# Altium project HIL_RIG_Hardware.PrjPcb (part 3 of 11)

## Sheet  Digital_Input.SchDoc
size A3; SheetNumber: 9; SheetTotal: 29
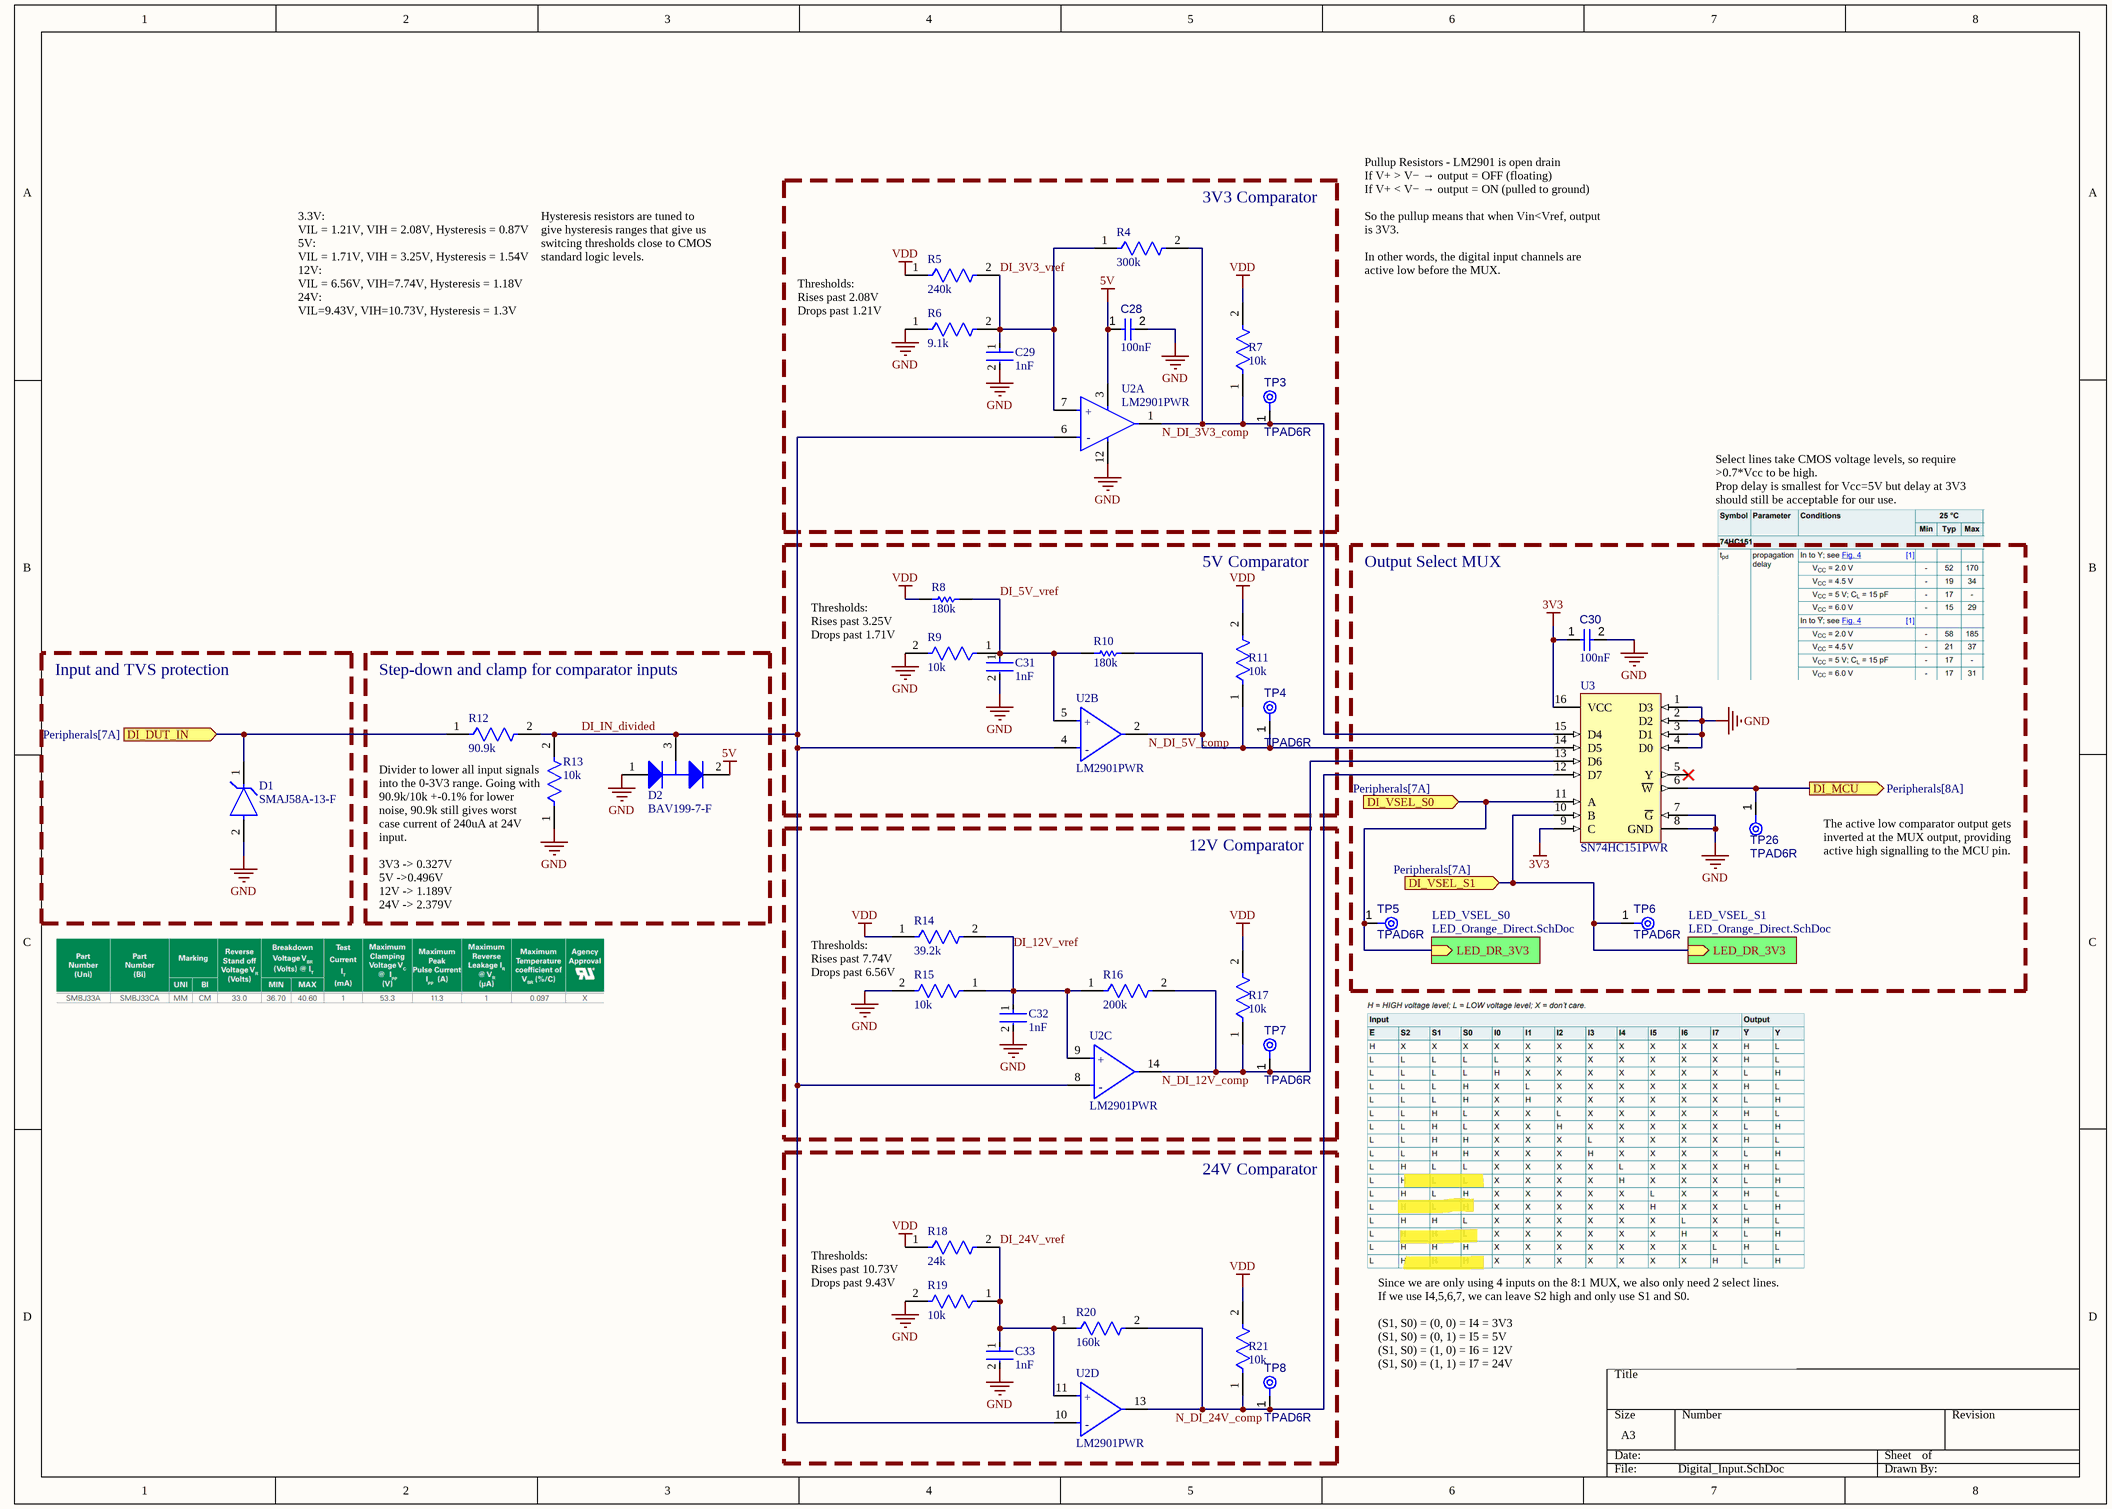
[diagram p5:  Digital_Input.SchDoc]

### Parts
C28  value 100nF  [CAPC1608X90X40NL10T20]  (hidden comment: Capacitor 100 nF +/-10% 50 V 0603)
C29  value 1nF  [FP-CC0603-DA-IPC_B]  (hidden comment: CC0603KRX7R7BB102)
C30  value 100nF  [CAPC1608X90X40NL10T20]  (hidden comment: Capacitor 100 nF +/-10% 50 V 0603)
C31  value 1nF  [FP-CC0603-DA-IPC_B]  (hidden comment: CC0603KRX7R7BB102)
C32  value 1nF  [FP-CC0603-DA-IPC_B]  (hidden comment: CC0603KRX7R7BB102)
C33  value 1nF  [FP-CC0603-DA-IPC_B]  (hidden comment: CC0603KRX7R7BB102)
D1  SMAJ58A-13-F  [FP-SMA-MFG]
D2  BAV199-7-F  [DIOD-SOT23-3_A_V]
R4  value 300k  [FP-RT0603-IPC_C]  (hidden comment: RT0603BRE07300KL)
R5  value 240k  [FP-RT0603-IPC_C]  (hidden comment: RT0603BRD07240KL)
R6  value 9.1k  [FP-RT0603-IPC_C]  (hidden comment: RT0603BRD079K1L)
R7  value 10k  [FP-RT0603-IPC_C]  (hidden comment: RT0603BRD0710KL)
R8  value 180k  [RESC1608X55X30NL20T20]  (hidden comment: ERA-3AEB184V)
R9  value 10k  [FP-RT0603-IPC_C]  (hidden comment: RT0603BRD0710KL)
R10  value 180k  [RESC1608X55X30NL20T20]  (hidden comment: ERA-3AEB184V)
R11  value 10k  [FP-RT0603-IPC_C]  (hidden comment: RT0603BRD0710KL)
R12  value 90.9k  [FP-RT0603-IPC_C]  (hidden comment: RT0603BRD0790K9L)
R13  value 10k  [FP-RT0603-IPC_C]  (hidden comment: RT0603BRD0710KL)
R14  value 39.2k  [FP-RT0603-IPC_C]  (hidden comment: RT0603BRD0739K2L)
R15  value 10k  [FP-RT0603-IPC_C]  (hidden comment: RT0603BRD0710KL)
R16  value 200k  [FP-AT0603-IPC_A]  (hidden comment: AT0603BRD07200KL)
R17  value 10k  [FP-RT0603-IPC_C]  (hidden comment: RT0603BRD0710KL)
R18  value 24k  [FP-TNPW0603-e3-IPC_A]  (hidden comment: TNPW060324K0BEEA)
R19  value 10k  [FP-RT0603-IPC_C]  (hidden comment: RT0603BRD0710KL)
R20  value 160k  [FP-RT0603-IPC_C]  (hidden comment: RT0603BRD07160KL)
R21  value 10k  [FP-RT0603-IPC_C]  (hidden comment: RT0603BRD0710KL)
TP3  TPAD6R  [TP06R]  (no BOM)
TP4  TPAD6R  [TP06R]  (no BOM)
TP5  TPAD6R  [TP06R]  (no BOM)
TP6  TPAD6R  [TP06R]  (no BOM)
TP7  TPAD6R  [TP06R]  (no BOM)
TP8  TPAD6R  [TP06R]  (no BOM)
TP26  TPAD6R  [TP06R]  (no BOM)
U2  LM2901PWR  [FP-PW0014A-IPC_B]  (parts A,B,C,D of 4)
U3  SN74HC151PWR  [PW0016A_L]

### Blocks framed on the sheet
3V3 Comparator: C28 C29 R4-R7 TP3 U2
5V Comparator: C31 R8-R11 TP4 U2
Output Select MUX: C30 TP5 TP6 TP26 U3
Input and TVS protection: D1
Step-down and clamp for comparator inputs: D2 R12 R13
12V Comparator: C32 R14-R17 TP7 U2
24V Comparator: C33 R18-R21 TP8 U2

### Sub-sheets
LED_VSEL_S0 = LED_Orange_Direct.SchDoc (file not in this document): LED_DR_3V3 (in)
LED_VSEL_S1 = LED_Orange_Direct.SchDoc (file not in this document): LED_DR_3V3 (in)

### Ports
DI_DUT_IN (in, see Peripherals[7A]), DI_MCU (out, see Peripherals[8A]), DI_VSEL_S0 (in, see Peripherals[7A]), DI_VSEL_S1 (in, see Peripherals[7A])

### Nets
3V3: C30.1 U3.9(C) U3.16(VCC)
5V: C28.1 D2.2(K) U2.3(VCC)
GND: C28.2 C29.2 C30.2 C31.2 C32.2 C33.2 D1.2(A) D2.1(A) R6.1 R9.2 R13.1 R15.2 R19.2 U2.12(GND) U3.1(D3) U3.2(D2) U3.3(D1) U3.4(D0) U3.7(~{G}) U3.8(GND)
VDD: R5.1 R7.2 R8.1 R11.2 R14.1 R17.2 R18.1 R21.2
DI_3V3_vref: C29.1 R4.1 R5.2 R6.2 U2.7(1IN+)
DI_5V_vref: C31.1 R8.2 R9.1 R10.1 U2.5(2IN+)
DI_12V_vref: C32.1 R14.2 R15.1 R16.1 U2.9(3IN+)
DI_24V_vref: C33.1 R18.2 R19.1 R20.1 U2.11(4IN+)
DI_IN_divided: D2.3(C) R12.2 R13.2 U2.4(2IN-) U2.6(1IN-) U2.8(3IN-) U2.10(4IN-)
N_DI_3V3_comp: R4.2 R7.1 TP3.1(TP) U2.1(1OUT) U3.15(D4)
N_DI_5V_comp: R10.2 R11.1 TP4.1(TP) U2.2(2OUT) U3.14(D5)
N_DI_12V_comp: R16.2 R17.1 TP7.1(TP) U2.14(OUT3) U3.13(D6)
N_DI_24V_comp: R20.2 R21.1 TP8.1(TP) U2.13(OUT4) U3.12(D7)
NetD1_1: D1.1(C) R12.1 ; port DI_DUT_IN
NetTP5_1: TP5.1(TP) U3.11(A) ; port DI_VSEL_S0, sheet LED_VSEL_S0/LED_DR_3V3
NetTP6_1: TP6.1(TP) U3.10(B) ; port DI_VSEL_S1, sheet LED_VSEL_S1/LED_DR_3V3
NetTP26_1: TP26.1(TP) U3.6(~{W}) ; port DI_MCU

Not connected (* = marked no-connect by the designer): U3 5(Y)*

### Notes on the sheet
- 3.3V:
  VIL = 1.21V, VIH = 2.08V, Hysteresis = 0.87V
  5V:
  VIL = 1.71V, VIH = 3.25V, Hysteresis = 1.54V
  12V:
  VIL = 6.56V, VIH=7.74V, Hysteresis = 1.18V
  24V:
  VIL=9.43V, VIH=10.73V, Hysteresis = 1.3V
- Hysteresis resistors are tuned to give hysteresis ranges that give us switcing thresholds close to CMOS standard logic levels.
- Pullup Resistors - LM2901 is open drain
  If V+ > V− → output = OFF (floating)
  If V+ < V− → output = ON (pulled to ground)
  So the pullup means that when Vin<Vref, output is 3V3.
  In other words, the digital input channels are active low before the MUX.
- Thresholds:
  Rises past 2.08V
  Drops past 1.21V
- Select lines take CMOS voltage levels, so require >0.7*Vcc to be high.
  Prop delay is smallest for Vcc=5V but delay at 3V3 should still be acceptable for our use.
- Thresholds:
  Rises past 3.25V
  Drops past 1.71V
- The active low comparator output gets inverted at the MUX output, providing active high signalling to the MCU pin.
- (near R13) Divider to lower all input signals into the 0-3V3 range. Going with 90.9k/10k +-0.1% for lower noise, 90.9k still gives worst case current of 240uA at 24V input.
  3V3 -> 0.327V
  5V ->0.496V
  12V -> 1.189V
  24V -> 2.379V
- Thresholds:
  Rises past 7.74V
  Drops past 6.56V
- Thresholds:
  Rises past 10.73V
  Drops past 9.43V
- Since we are only using 4 inputs on the 8:1 MUX, we also only need 2 select lines.
  If we use I4,5,6,7, we can leave S2 high and only use S1 and S0.
  (S1, S0) = (0, 0) = I4 = 3V3
  (S1, S0) = (0, 1) = I5 = 5V
  (S1, S0) = (1, 0) = I6 = 12V
  (S1, S0) = (1, 1) = I7 = 24V

### Library data of the parts
C28 C30 = CMP-001-00017-6: Chip Capacitor, 100 nF, +/- 10%, 50 V, 0603 (1608 Metric); Voltage Rating: 50V; Capacitor Type: Ceramic; Tolerance: 10%; Mounting Technology: SM; Max Operating Temperature: 125°C; RoHS Compliant: True; Pins: 2; Case/Package: 0603; Min Operating Temperature: -55°C
C29 C31-C33 = CMP-001-00137-1: 16V 1nF X7R ±10% 0603 Multilayer Ceramic Capacitors MLCC - SMD/SMT ROHS; Min Operating Temperature: -55°C; Dielectric Material: Ceramic; Max Operating Temperature: 125°C; REACH SVHC: Yes; Lifecycle Status: Production; Voltage Rating: 16V; Mounting Technology: Surface Mount; Width: 800µm; Height: 800µm; Case/Package: 0603; RoHS: Compliant; Voltage Rating (DC): 16V; Length: 1.6mm; Number of Terminals: 2; Tolerance: 10%; Dielectric: X7R; Material: Ceramic; China RoHS: Compliant; Case Code (Imperial): 0603; Case Code (Metric): 1608; Composition: Ceramic; Depth: 800µm; Halogen Free: Halogen Free; Lead Free: Lead Free; Packaging: Tape and Reel; Radiation Hardening: No; Schedule B: 8532240020, 8532240020; Termination: SMD/SMT; Thickness: 889µm; Weight: 2.012816mg
D1 = CMP-004-00082-1: SMAJ Series 58 V 400 W SMT Uni-Directional TVS Diode - DO-214AC; Forward Voltage: 3.5V; Max Surge Current: 40A; Case/Package: SMA; Max Operating Temperature: 150°C; Min Operating Temperature: -55°C; Mounting Technology: Surface Mount; Pins: 2
D2 = CMP-004-00056-1: Diode Standard Recovery Rectifier 85 Volt 0.16A 3-Pin SOT-23 Tape and Reel; Max Surge Current: 4A; Forward Current: 150mA; Forward Voltage: 900mV; Pins: 3; Case/Package: SOT-23; Max Operating Temperature: 150°C; Mounting Technology: Surface Mount; Min Operating Temperature: -65°C
R4 = CMP-009-00251-1: 100mW Thin Film Resistor ±50ppm/℃ ±0.1% 300kΩ 0603 Chip Resistor - Surface Mount ROHS; Voltage Rating (DC): 50V; Voltage Rating: 75V; Temperature Coefficient: 50ppm/°C; Min Operating Temperature: -55°C; Export Control Classification Number (ECCN) Code: EAR99; China RoHS: Non-Compliant; Number of Terminals: 2; Max Power Dissipation: 100mW; Radiation Hardening: No; Mounting Technology: Surface Mount; Width: 800µm; Case Code (Metric): 0603; RoHS: Compliant; Contact Plating: Tin; Lead Free: Lead Free; Power Dissipation: 100mW; Packaging: Tape & Reel (TR); Height: 450µm; Tolerance: 0.1%; REACH SVHC: Yes; Harmonized Tariff Schedule (HTS) Code: 8533.21.00.30; Length: 1.6mm; Max Operating Temperature: 155°C; Working Voltage: 75V; Case/Package: 0603; Power Rating: 100mW; Number of Terminations: 2; Country of Origin: Mainland China, Taiwan; Introduction Date: 2008-07-11; Lifecycle Status: Production; Composition: Thin Film
R5 = CMP-009-00288-1: Res Thin Film 0603 240K Ohm 0.1% 0.1W(1/10W) ±25ppm/C Pad SMD T/R; Temperature Coefficient: 25ppm/°C; Power Rating: 100mW; Voltage Rating (DC): 50V; Working Voltage: 75V; Height: 450µm; Max Operating Temperature: 155°C; Case/Package: 0603; Composition: Thin Film; China RoHS: Non-Compliant; Lifecycle Status: Production; Harmonized Tariff Schedule (HTS) Code: 8533.21.00.30; RoHS: Compliant; Mounting Technology: Surface Mount; Introduction Date: 2008-06-09; Tolerance: 0.1%; Features: Moisture Resistant; Export Control Classification Number (ECCN) Code: EAR99; Case Code (Imperial): 0603; Max Power Dissipation: 100mW; Voltage Rating: 75V; Min Operating Temperature: -55°C; Country of Origin: Mainland China, Taiwan; Schedule B: 8533210045, 8533210045; Number of Terminations: 2; Lead Free: Lead Free; Number of Terminals: 2; Length: 1.6mm; REACH SVHC: Yes; Width: 800µm; Radiation Hardening: No; Contact Plating: Tin; Termination: SMD/SMT
R6 = CMP-009-00287-1: 100mW Thin Film Resistor 75V ±25ppm/℃ ±0.1% 9.1kΩ 0603 Chip Resistor - Surface Mount ROHS; Temperature Coefficient: 25ppm/°C; Voltage Rating (DC): 50V; Case/Package: 0603; REACH SVHC: Yes; Height: 450µm; Max Operating Temperature: 155°C; Width: 800µm; Termination: SMD/SMT; Weight: 2.012816mg; Lead Free: Lead Free; Radiation Hardening: No; Number of Terminals: 2; Harmonized Tariff Schedule (HTS) Code: 8533.21.00.30; RoHS: Compliant; Composition: Thin Film; Case Code (Imperial): 0603; Country of Origin: Mainland China, Taiwan; Max Power Dissipation: 100mW; Voltage Rating: 75V; Introduction Date: 2008-07-11; Depth: 800µm; Number of Terminations: 2; Length: 1.6mm; Export Control Classification Number (ECCN) Code: EAR99; Military Standard: Not; Schedule B: 8533210045, 8533210045; Tolerance: 0.1%; Working Voltage: 75V; Lifecycle Status: Production; Power Rating: 100mW; Mounting Technology: Surface Mount; Features: Moisture Resistant; Min Operating Temperature: -55°C; Contact Plating: Tin; China RoHS: Non-Compliant
R7 R11 R17 R21 = CMP-009-00322-1: Res Thin Film 0603 10K Ohm 0.1% 1/10W |25ppm/|C SMD Paper T/R; Voltage Rating: 75V; Max Power Dissipation: 100mW; Temperature Coefficient: 25ppm/°C; Min Operating Temperature: -55°C; Case/Package: 0603; Mounting Technology: Surface Mount; Max Operating Temperature: 155°C; Tolerance: 0.1%; Case Code (Imperial): 0603; China RoHS: Non-Compliant; Composition: Thin Film; Country of Origin: Mainland China, Taiwan; Depth: 800µm; Export Control Classification Number (ECCN) Code: EAR99; Features: Moisture Resistant; Harmonized Tariff Schedule (HTS) Code: 8533.21.00.30; Height: 450µm; Introduction Date: 2008-06-09; Lead Free: Lead Free; Length: 1.6mm; Lifecycle Status: Production; Military Standard: Not; Number of Terminals: 2; Number of Terminations: 2; Power Rating: 100mW; REACH SVHC: Yes; RoHS: Compliant; Schedule B: 8533210045, 8533210045; Termination: SMD/SMT; Voltage Rating (DC): 75V; Weight: 2.012816mg; Width: 800µm; Working Voltage: 75V
R8 R10 = CMP-009-00332-1: Res Thin Film 0603 180K Ohm 0.1% 0.1W ±25ppm/°C Molded SMD Punched Carrier T/R; Manufacturer Lifecycle Status: ACTIVE; Part Series: Thin Film Chip Resistors, High Reliability Type; Max Power Dissipation: 100mW; Voltage Rating (DC): 75V; Min Operating Temperature: -55°C; Termination: SMD/SMT; Features: Automotive AEC-Q200; Radiation Hardening: No; REACH SVHC: Yes; Lifecycle Status: Production; Contact Plating: Tin; Mounting Technology: Surface Mount; Ratings: AEC-Q200; Case/Package: 0603; Depth: 800µm; Harmonized Tariff Schedule (HTS) Code: 8533.21.00.30; Schedule B: 8533210045, 8533210045; Composition: Thin Film; Number of Terminations: 2; Country of Origin: Japan; RoHS: Compliant; Working Voltage: 75V; Introduction Date: 2008-03-19; Temperature Coefficient: 25ppm/°C; Case Code (Imperial): 0603; Tolerance: 0.1%; Voltage Rating: 75V; Military Standard: Not; Packaging: Cut Tape; Power Rating: 100mW; Export Control Classification Number (ECCN) Code: EAR99; Number of Terminals: 2; Length: 1.6mm; Height: 450µm; Max Operating Temperature: 155°C; Lead Free: Lead Free; Pins: 2; Width: 800µm
R9 R13 R15 R19 = CMP-009-00322-1: Res Thin Film 0603 10K Ohm 0.1% 1/10W |25ppm/|C SMD Paper T/R; Power Rating: 100mW; Voltage Rating: 75V; Temperature Coefficient: 25ppm/°C; Width: 800µm; Country of Origin: Mainland China, Taiwan; Military Standard: Not; China RoHS: Non-Compliant; Composition: Thin Film; Schedule B: 8533210045, 8533210045; Max Operating Temperature: 155°C; Export Control Classification Number (ECCN) Code: EAR99; Lead Free: Lead Free; Number of Terminals: 2; Voltage Rating (DC): 75V; Introduction Date: 2008-06-09; Tolerance: 0.1%; Number of Terminations: 2; Case/Package: 0603; Depth: 800µm; Max Power Dissipation: 100mW; RoHS: Compliant; Harmonized Tariff Schedule (HTS) Code: 8533.21.00.30; Lifecycle Status: Production; Length: 1.6mm; Min Operating Temperature: -55°C; Features: Moisture Resistant; Case Code (Imperial): 0603; REACH SVHC: Yes; Mounting Technology: Surface Mount; Working Voltage: 75V; Height: 450µm; Termination: SMD/SMT; Weight: 2.012816mg
R12 = CMP-009-00290-1: 100mW Thin Film Resistor 75V ±25ppm/℃ ±0.1% 90.9kΩ 0603 Chip Resistor - Surface Mount ROHS; Temperature Coefficient: 25ppm/°C; Voltage Rating (DC): 50V; Features: Moisture Resistant; Schedule B: 8533210045, 8533210045; Case Code (Imperial): 0603; Radiation Hardening: No; Composition: Thin Film; Working Voltage: 75V; Harmonized Tariff Schedule (HTS) Code: 8533.21.00.30; Country of Origin: Mainland China, Taiwan; Lifecycle Status: Production; Export Control Classification Number (ECCN) Code: EAR99; Number of Terminals: 2; China RoHS: Non-Compliant; Width: 800µm; Number of Terminations: 2; Termination: SMD/SMT; Max Operating Temperature: 155°C; Introduction Date: 2008-06-09; Tolerance: 0.1%; Max Power Dissipation: 100mW; Military Standard: Not; RoHS: Compliant; Power Rating: 100mW; Voltage Rating: 75V; Height: 450µm; Min Operating Temperature: -55°C; Case/Package: 0603; Depth: 800µm; Length: 1.6mm; REACH SVHC: Yes; Lead Free: Lead Free; Contact Plating: Tin; Mounting Technology: Surface Mount
R14 = CMP-009-00347-1: 100mW Thin Film Resistor ±25ppm/℃ ±0.1% 39.2kΩ 0603 Chip Resistor - Surface Mount ROHS; Temperature Coefficient: 25ppm/°C; Voltage Rating: 75V; Voltage Rating (DC): 50V; Width: 800µm; Contact Plating: Tin; Mounting Technology: Surface Mount; Min Operating Temperature: -55°C; Case/Package: 0603; Termination: SMD/SMT; Case Code (Imperial): 0603; Number of Terminations: 2; Max Power Dissipation: 100mW; Lead Free: Lead Free; Schedule B: 8533210045, 8533210045; China RoHS: Non-Compliant; Height: 450µm; Length: 1.6mm; Military Standard: Not; Features: Moisture Resistant; Power Rating: 100mW; REACH SVHC: Yes; Radiation Hardening: No; Tolerance: 0.1%; Max Operating Temperature: 155°C; Lifecycle Status: Production; Working Voltage: 75V; Weight: 2.012816mg; Number of Terminals: 2; Composition: Thin Film; Depth: 800µm; RoHS: Compliant
R16 = CMP-009-00344-1: 100mW Thin Film Resistor ±25ppm/℃ ±0.1% 200kΩ 0603 Chip Resistor - Surface Mount ROHS; Voltage Rating: 75V; Temperature Coefficient: 25ppm/°C; Lifecycle Status: Production; Length: 1.6mm; Min Operating Temperature: -55°C; Number of Terminals: 2; Width: 800µm; Introduction Date: 2015-05-11; Mounting Technology: Surface Mount; Features: Anti-Sulfur, Automotive AEC-Q200, Moisture Resistant; Country of Origin: Mainland China, Taiwan; Tolerance: 0.1%; Export Control Classification Number (ECCN) Code: EAR99; Max Power Dissipation: 100mW; RoHS: Compliant; Power Rating: 100mW; Case/Package: 0603; Number of Terminations: 2; Working Voltage: 75V; Composition: Thin Film; REACH SVHC: Yes; Harmonized Tariff Schedule (HTS) Code: 8533.21.00.30; Max Operating Temperature: 155°C; China RoHS: Compliant; Height: 450µm; Ratings: AEC-Q200
R18 = CMP-009-00298-1: Res Thin Film 0603 24K Ohm 0.1% 1/8W ±25ppm/°C Molded SMD SMD Paper T/R; Max Power Dissipation: 100mW; Working Voltage: 75V; Voltage Rating (DC): 50V; Military Standard: Not; Radiation Hardening: No; Tolerance: 0.1%; Lifecycle Status: Production; Length: 1.55mm; Packaging: Tape & Reel; China RoHS: Compliant; Export Control Classification Number (ECCN) Code: EAR99; Lead Free: Lead Free; Number of Terminals: 2; Min Operating Temperature: -55°C; Depth: 850µm; Weight: 2.012816mg; Contact Plating: Tin; Composition: Thin Film; Country of Origin: Germany, Israel; Schedule B: 8533210045, 8533210045; Power Rating: 100mW; Case Code (Metric): 1608; Termination: SMD/SMT; Width: 850µm; Height: 450µm; Number of Terminations: 2; Introduction Date: 2006-07-14; Ratings: AEC-Q200; Case Code (Imperial): 0603; Voltage Rating: 75V; Mounting Technology: Surface Mount; Case/Package: 0603; REACH SVHC: Yes; Temperature Coefficient: 25ppm/°C; RoHS: Compliant; Harmonized Tariff Schedule (HTS) Code: 8533.21.00.30; Max Operating Temperature: 125°C; Features: Anti-Sulfur, Automotive AEC-Q200, Moisture Resistant; Pins: 2
R20 = CMP-009-00297-1: Res Thin Film 0603 160K Ohm 0.1% 0.1W(1/10W) ±25ppm/C Pad SMD T/R; Voltage Rating (DC): 50V; Temperature Coefficient: 25ppm/°C; Power Rating: 100mW; Working Voltage: 75V; Max Operating Temperature: 155°C; Tolerance: 0.1%; Case/Package: 0603; Composition: Thin Film; Mounting Technology: Surface Mount; Schedule B: 8533210045, 8533210045; Radiation Hardening: No; Military Standard: Not; Number of Terminals: 2; Number of Terminations: 2; Lifecycle Status: Production; China RoHS: Non-Compliant; Depth: 800µm; REACH SVHC: Yes; Max Power Dissipation: 100mW; Length: 1.6mm; Features: Moisture Resistant; Width: 800µm; Height: 450µm; Case Code (Imperial): 0603; Contact Plating: Tin; Termination: SMD/SMT; Voltage Rating: 75V; Lead Free: Lead Free; RoHS: Compliant; Weight: 2.012816mg; Min Operating Temperature: -55°C
TP3-TP8 TP26 = CMP-00028-00002-2: 0.6mm round; Pins: 1
U2 = CMP-014-00007-1: Cut Tape (CT) LM2901 CMOS MOS Open-Collector TTL 0.25muA comparator circuit 250nA 1.3mus 5mm 9V; Manufacturer Lifecycle Status: ACTIVE; Min Dual Supply Voltage: 1V; Max Supply Voltage: 30V; Max Supply Current: 2mA; Max Dual Supply Voltage: 15V; Max Junction Temperature (Tj): 125°C; Input Bias Current: -25nA; Number of Channels: 4; Input Offset Voltage (Vos): 2mV; Response Time: 1.3µs; Voltage Gain: 100dB; Min Supply Voltage: 2V; Operating Supply Voltage: 28V; Output Current per Channel: 20mA; Quiescent Current: 2.5mA; Mounting Technology: Surface Mount; Min Operating Temperature: -40°C; Lifecycle Status: Production; Max Input Current: 250nA; Length: 5mm; Lead Free: Lead Free; REACH SVHC: No; Height: 0m; Dual Supply Voltage: 9V; Thickness: 1mm; Pins: 14; Weight: 57.209338mg; Schedule B: 8542390000, 8542390000; Width: 4.4mm; Contact Plating: Gold; Packaging: Cut Tape; Radiation Hardening: No; Number of Elements: 4; Output Type: TTL; RoHS: Compliant; Max Operating Temperature: 125°C; Nominal Supply Current: 2mA; Case/Package: TSSOP
U3 = CMP-031-00026-2: Multiplexer 1-ELEMENT Cmos 8-IN 16-PIN TSSOP T/r / IC Selector/mux 8-1LINE 16-TSSOP; Manufacturer Lifecycle Status: ACTIVE; Min Supply Voltage: 2V; Low Level Output Current: 7.8mA; Number of Bits: 8; Number of Outputs: 1; Bandwidth: 28MHz; Supply Type: Single; Propagation Delay: 47ns; Max Supply Voltage: 6V; Operating Supply Voltage: 5V; Lead Free: Lead Free; Length: 5mm; Number of Channels: 1; Max Operating Temperature: 85°C; High Level Output Current: 7.8mA; Lifecycle Status: Production; Number of Input Lines: 8; Independent Circuits: 1; Contact Plating: Gold; Number of Output Lines: 1; Case/Package: TSSOP; Pins: 16; Schedule B: 8542390000, 8542390000; Number of Inputs: 8; Mounting Technology: Surface Mount; Min Operating Temperature: -40°C; Logic Function: Multiplexer; Thickness: 1mm; Width: 4.4mm; Radiation Hardening: No; RoHS: Compliant; Weight: 61.887009mg; Height: 1.2mm

## Sheet  Power.SchDoc
size A3; SheetNumber: 21; SheetTotal: 29
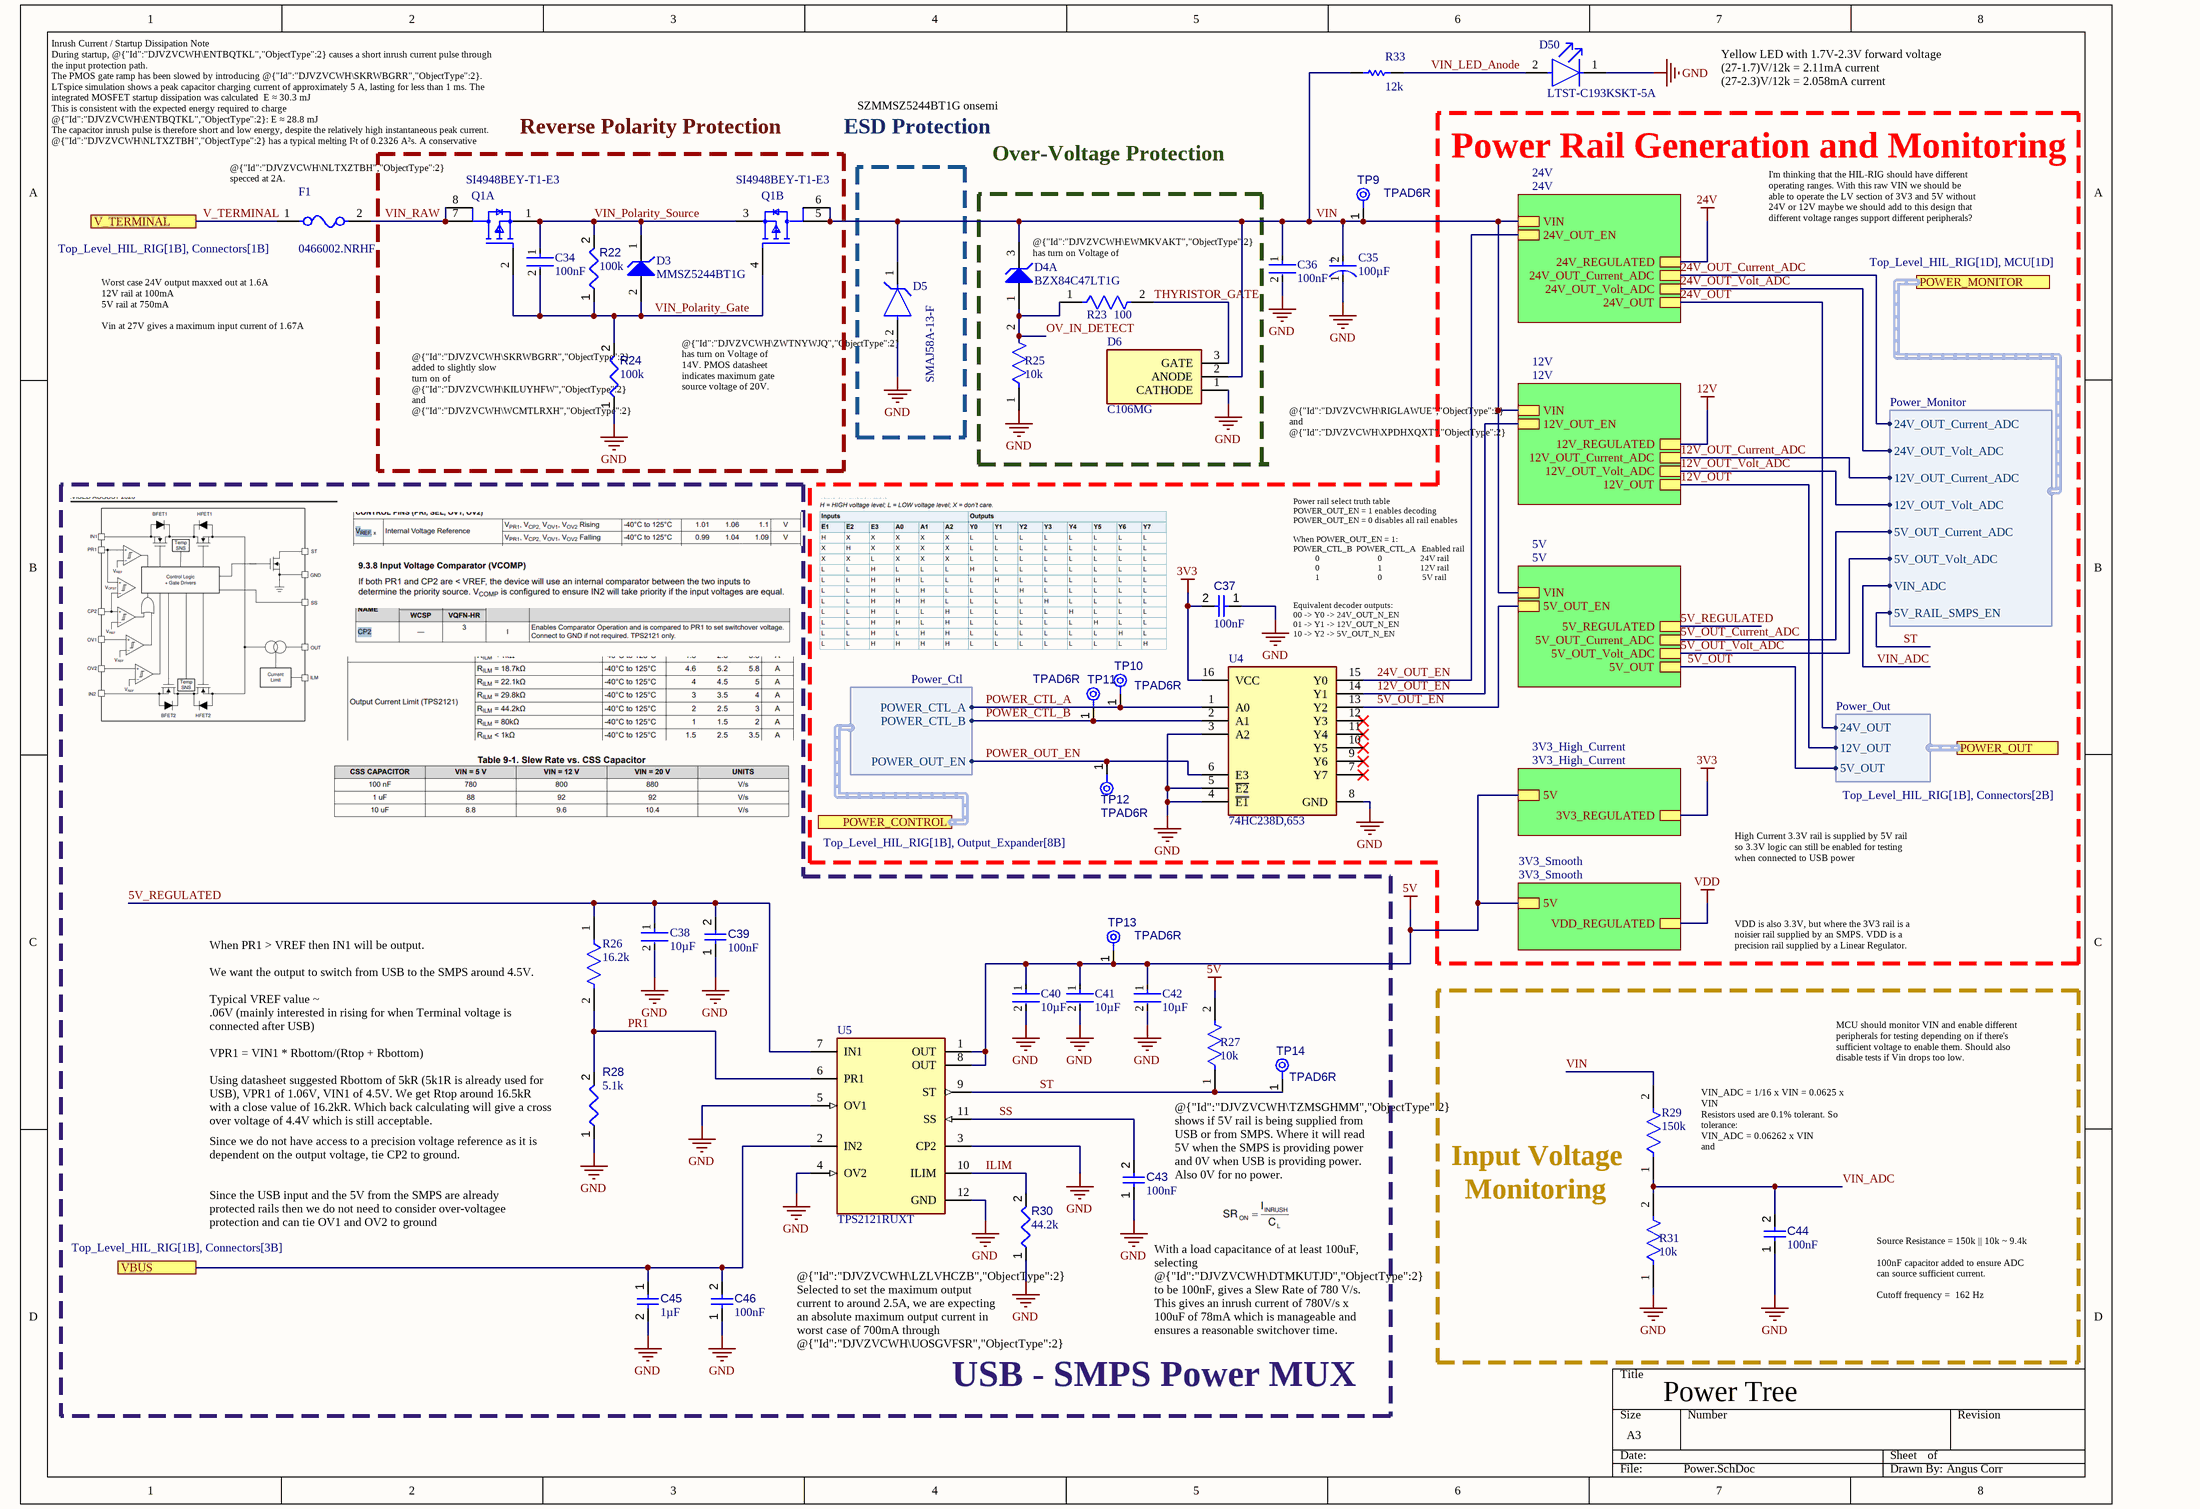
[diagram p6:  Power.SchDoc]

### Parts
C34  value 100nF  [FP-GRM31C-0_2-e0_3_0_8-IPC_C]  (hidden comment: GRM31C5C2A104JA01L)
C35  value 100µF  [FP-MVYAKE0-MFG]  (hidden comment: EMVY101ARA101MKE0S)
C36  value 100nF  [FP-GRM31C-0_2-e0_3_0_8-IPC_C]  (hidden comment: GRM31C5C2A104JA01L)
C37  value 100nF  [CAPC1608X90X40NL10T20]  (hidden comment: Capacitor 100 nF +/-10% 50 V 0603)
C38  value 10µF  [FP-GRM31C-0_2-e0_3_0_8-IPC_C]  (hidden comment: GRM31CR71E106KA12L)
C39  value 100nF  [CAPC1608X90X40NL10T20]  (hidden comment: Capacitor 100 nF +/-10% 50 V 0603)
C40  value 10µF  [FP-GRM31C-0_2-e0_3_0_8-IPC_C]  (hidden comment: GRM31CR71E106KA12L)
C41  value 10µF  [FP-GRM31C-0_2-e0_3_0_8-IPC_C]  (hidden comment: GRM31CR71E106KA12L)
C42  value 10µF  [FP-GRM31C-0_2-e0_3_0_8-IPC_C]  (hidden comment: GRM31CR71E106KA12L)
C43  value 100nF  [CAPC1608X90X40NL10T20]  (hidden comment: Capacitor 100 nF +/-10% 50 V 0603)
C44  value 100nF  [CAPC1608X90X40NL10T20]  (hidden comment: Capacitor 100 nF +/-10% 50 V 0603)
C45  value 1µF  [CAPC1608X90X40LL10T20]  (hidden comment: Capacitor 1 uF +/- 10% 25 V 0603)
C46  value 100nF  [CAPC1608X90X40NL10T20]  (hidden comment: Capacitor 100 nF +/-10% 50 V 0603)
D3  MMSZ5244BT1G  [ONSC-SOD-123-2-425-04_V]
D4  BZX84C47LT1G  [ONSC-SOT-23-3-318-08_V]  (part A of 2)
D5  SMAJ58A-13-F  [FP-SMA-MFG]
D6  C106MG  [TO229P280X780X1410-3P]
D50  LTST-C193KSKT-5A  [FP-LTST-C193KGKT-5A-MFG]
F1  0466002.NRHF  [FP-0466-MFG]
Q1  SI4948BEY-T1-E3  [FP-C-06527-IPC_B]  (parts A,B of 2)
R22  value 100k  [FP-AC0603-IPC_C]  (hidden comment: AC0603FR-07100KL)
R23  value 100  [FP-RT0603-IPC_C]  (hidden comment: RT0603BRD07100RL)
R24  value 100k  [FP-AC0603-IPC_C]  (hidden comment: AC0603FR-07100KL)
R25  value 10k  [FP-RT0603-IPC_C]  (hidden comment: RT0603BRD0710KL)
R26  value 16.2k  [FP-RT0603-IPC_C]  (hidden comment: RT0603BRD0716K2L)
R27  value 10k  [FP-RT0603-IPC_C]  (hidden comment: RT0603BRD0710KL)
R28  value 5.1k  [FP-AC0603-IPC_C]  (hidden comment: AC0603FR-075K1L)
R29  value 150k  [FP-RT0805-MFG]  (hidden comment: RT0805BRD07150KL)
R30  value 44.2k  [FP-AC0603-IPC_C]  (hidden comment: AC0603FR-0744K2L)
R31  value 10k  [FP-RT0603-IPC_C]  (hidden comment: RT0603BRD0710KL)
R33  value 12k  [RESC1608X55X25LL10T15]  (hidden comment: RC0603FR-0712KL)
TP9  TPAD6R  [TP06R]  (no BOM)
TP10  TPAD6R  [TP06R]  (no BOM)
TP11  TPAD6R  [TP06R]  (no BOM)
TP12  TPAD6R  [TP06R]  (no BOM)
TP13  TPAD6R  [TP06R]  (no BOM)
TP14  TPAD6R  [TP06R]  (no BOM)
U4  74HC238D,653  [74HC238D653]
U5  TPS2121RUXT  [FP-RUX0012A-MFG]

### Blocks framed on the sheet
USB - SMPS Power MUX: C38-C43 C45 C46 R26-R28 R30 TP13 TP14 U5

### Sub-sheets
3V3_High_Current = 3V3_High_Current (file not in this document): 5V, 3V3_REGULATED
3V3_Smooth = 3V3_Smooth (file not in this document): 5V, VDD_REGULATED
5V = 5V (file not in this document): VIN, 5V_REGULATED, 5V_OUT, 5V_OUT_EN, 5V_OUT_Volt_ADC, 5V_OUT_Current_ADC
12V = 12V (file not in this document): VIN, 12V_REGULATED, 12V_OUT, 12V_OUT_EN, 12V_OUT_Current_ADC, 12V_OUT_Volt_ADC
24V = 24V (file not in this document): VIN, 24V_REGULATED, 24V_OUT, 24V_OUT_EN, 24V_OUT_Current_ADC, 24V_OUT_Volt_ADC

### Ports
POWER_CONTROL (harness Power_Ctl, see Top_Level_HIL_RIG[1B], Output_Expander[8B]), POWER_MONITOR (harness Power_Monitor, see Top_Level_HIL_RIG[1D], MCU[1D]), POWER_OUT (harness Power_Out, see Top_Level_HIL_RIG[1B], Connectors[2B]), V_TERMINAL (see Top_Level_HIL_RIG[1B], Connectors[1B]), VBUS (see Top_Level_HIL_RIG[1B], Connectors[3B])

### Harnesses
Power_Out: 24V_OUT, 12V_OUT, 5V_OUT
Power_Ctl: POWER_OUT_EN, POWER_CTL_A, POWER_CTL_B
Power_Monitor: 24V_OUT_Current_ADC, 24V_OUT_Volt_ADC, 12V_OUT_Current_ADC, 12V_OUT_Volt_ADC, 5V_OUT_Current_ADC, 5V_OUT_Volt_ADC, VIN_ADC, 5V_RAIL_SMPS_EN

### Nets
3V3: C37.2 U4.16(VCC) ; sheet 3V3_High_Current/3V3_REGULATED
5V: C40.1 C41.1 C42.1 R27.2 TP13.1(TP) U5.1(OUT) U5.8(OUT) ; sheet 3V3_Smooth/5V, sheet 3V3_High_Current/5V
GND: C35.1(C) C36.2 C37.1 C38.2 C39.1 C40.2 C41.2 C42.2 C43.1 C44.1 C45.2 C46.1 D5.2(A) D6.1(CATHODE) D50.1(C) R24.1 R25.1 R28.1 R30.1 R31.1 U4.3(A2) U4.4(~{E1}) U4.5(~{E2}) U4.8(GND) U5.3(CP2) U5.4(OV2) U5.5(OV1) U5.12(GND)
5V_OUT: sheet 5V/5V_OUT, port POWER_OUT.5V_OUT
5V_OUT_Current_ADC: sheet 5V/5V_OUT_Current_ADC, port POWER_MONITOR.5V_OUT_Current_ADC
5V_OUT_EN: U4.13(Y2) ; sheet 5V/5V_OUT_EN
5V_OUT_Volt_ADC: sheet 5V/5V_OUT_Volt_ADC, port POWER_MONITOR.5V_OUT_Volt_ADC
5V_REGULATED: C38.1 C39.2 R26.1 U5.7(IN1) ; sheet 5V/5V_REGULATED
12V_OUT: sheet 12V/12V_OUT, port POWER_OUT.12V_OUT
12V_OUT_Current_ADC: sheet 12V/12V_OUT_Current_ADC, port POWER_MONITOR.12V_OUT_Current_ADC
12V_OUT_EN: U4.14(Y1) ; sheet 12V/12V_OUT_EN
12V_OUT_Volt_ADC: sheet 12V/12V_OUT_Volt_ADC, port POWER_MONITOR.12V_OUT_Volt_ADC
24V_OUT: sheet 24V/24V_OUT, port POWER_OUT.24V_OUT
24V_OUT_Current_ADC: sheet 24V/24V_OUT_Current_ADC, port POWER_MONITOR.24V_OUT_Current_ADC
24V_OUT_EN: U4.15(Y0) ; sheet 24V/24V_OUT_EN
24V_OUT_Volt_ADC: sheet 24V/24V_OUT_Volt_ADC, port POWER_MONITOR.24V_OUT_Volt_ADC
ILIM: R30.2 U5.10(ILIM)
OV_IN_DETECT: D4.1(A) R23.1 R25.2
POWER_CTL_A: TP10.1(TP) U4.1(A0) ; port POWER_CONTROL.POWER_CTL_A
POWER_CTL_B: TP11.1(TP) U4.2(A1) ; port POWER_CONTROL.POWER_CTL_B
POWER_OUT_EN: TP12.1(TP) U4.6(E3) ; port POWER_CONTROL.POWER_OUT_EN
PR1: R26.2 R28.2 U5.6(PR1)
SS: C43.2 U5.11(SS)
ST: R27.1 TP14.1(TP) U5.9(ST) ; port POWER_MONITOR.5V_RAIL_SMPS_EN
THYRISTOR_GATE: D6.3(GATE) R23.2
V_TERMINAL: F1.1 ; port V_TERMINAL
VIN: C35.2(A) C36.1 D4.3(K) D5.1(C) D6.2(ANODE) Q1.5(D2) Q1.6(D2) R29.2 R33.1 TP9.1(TP) ; sheet 24V/VIN, sheet 12V/VIN, sheet 5V/VIN
VIN_ADC: C44.2 R29.1 R31.2 ; port POWER_MONITOR.VIN_ADC
VIN_LED_Anode: D50.2(A) R33.2
VIN_Polarity_Gate: C34.2 D3.2(A) Q1.2(G1) Q1.4(G2) R22.1 R24.2
VIN_Polarity_Source: C34.1 D3.1(K) Q1.1(S1) Q1.3(S2) R22.2
VIN_RAW: F1.2 Q1.7(D1) Q1.8(D1)
NetC45_1: C45.1 C46.2 U5.2(IN2) ; port VBUS

Not connected (* = marked no-connect by the designer): U4 7(Y7)* 9(Y6)* 10(Y5)* 11(Y4)* 12(Y3)*

### Notes on the sheet
- SZMMSZ5244BT1G onsemi
- Yellow LED with 1.7V-2.3V forward voltage
  (27-1.7)V/12k = 2.11mA current
  (27-2.3)V/12k = 2.058mA current
- Inrush Current / Startup Dissipation Note
  During startup, @{"Id":"DJVZVCWH\ENTBQTKL","ObjectType":2} causes a short inrush current pulse through the input protection path.
  The PMOS gate ramp has been slowed by introducing @{"Id":"DJVZVCWH\SKRWBGRR","ObjectType":2}. LTspice simulation shows a peak capacitor charging current of approximately 5 A, lasting for less than 1 ms. The integrated MOSFET startup dissipation was calculated  E ≈ 30.3 mJ
  This is consistent with the expected energy required to charge @{"Id":"DJVZVCWH\ENTBQTKL","ObjectType":2}: E ≈ 28.8 mJ
  The capacitor inrush pulse is therefore short and low energy, despite the relatively high instantaneous peak current.
  @{"Id":"DJVZVCWH\NLTXZTBH","ObjectType":2} has a typical melting I²t of 0.2326 A²s. A conservative estimate for a 5 A, 1 ms startup pulse is: I²t = 0.025 A²s
  This is well below the fuse’s typical melting I²t, so the startup pulse is not expected to open or significantly stress the fuse.
- (near F1) @{"Id":"DJVZVCWH\NLTXZTBH","ObjectType":2} specced at 2A.
- Reverse Polarity Protection
- ESD Protection
- Over-Voltage Protection
- Power Rail Generation and Monitoring
- I'm thinking that the HIL-RIG should have different operating ranges. With this raw VIN we should be able to operate the LV section of 3V3 and 5V without 24V or 12V maybe we should add to this design that different voltage ranges support different peripherals?
- (near D4) @{"Id":"DJVZVCWH\EWMKVAKT","ObjectType":2} has turn on Voltage of 47V.
- Worst case 24V output maxxed out at 1.6A
  12V rail at 100mA
  5V rail at 750mA
  Vin at 27V gives a maximum input current of 1.67A
- @{"Id":"DJVZVCWH\SKRWBGRR","ObjectType":2} added to slightly slow turn on of @{"Id":"DJVZVCWH\KILUYHFW","ObjectType":2} and @{"Id":"DJVZVCWH\WCMTLRXH","ObjectType":2} which will limit inrush current on startup.
- @{"Id":"DJVZVCWH\ZWTNYWJQ","ObjectType":2} has turn on Voltage of 14V. PMOS datasheet indicates maximum gate source voltage of 20V.
- @{"Id":"DJVZVCWH\RIGLAWUE","ObjectType":2} and @{"Id":"DJVZVCWH\XPDHXQXT","ObjectType":2} provide discharge path for bulk capacitors
- (near U4) Power rail select truth table
  POWER_OUT_EN = 1 enables decoding
  POWER_OUT_EN = 0 disables all rail enables
  When POWER_OUT_EN = 1:
  POWER_CTL_B  POWER_CTL_A   Enabled rail
  0                             0                   24V rail
  0                             1                   12V rail
  1                             0                    5V rail
  Equivalent decoder outputs:
  00 -> Y0 -> 24V_OUT_N_EN
  01 -> Y1 -> 12V_OUT_N_EN
  10 -> Y2 -> 5V_OUT_N_EN
- High Current 3.3V rail is supplied by 5V rail so 3.3V logic can still be enabled for testing when connected to USB power
- VDD is also 3.3V, but where the 3V3 rail is a noisier rail supplied by an SMPS. VDD is a precision rail supplied by a Linear Regulator.
- When PR1 > VREF then IN1 will be output.
  We want the output to switch from USB to the SMPS around 4.5V.
  Typical VREF value ~
  .06V (mainly interested in rising for when Terminal voltage is connected after USB)
  VPR1 = VIN1 * Rbottom/(Rtop + Rbottom)
  Using datasheet suggested Rbottom of 5kR (5k1R is already used for USB), VPR1 of 1.06V, VIN1 of 4.5V. We get Rtop around 16.5kR with a close value of 16.2kR. Which back calculating will give a cross over voltage of 4.4V which is still acceptable.
- MCU should monitor VIN and enable different peripherals for testing depending on if there's sufficient voltage to enable them. Should also disable tests if Vin drops too low.
- (near R28) Since we do not have access to a precision voltage reference as it is dependent on the output voltage, tie CP2 to ground.
- @{"Id":"DJVZVCWH\TZMSGHMM","ObjectType":2} shows if 5V rail is being supplied from USB or from SMPS. Where it will read 5V when the SMPS is providing power and 0V when USB is providing power. Also 0V for no power.
- (near R29) Input Voltage
- VIN_ADC = 1/16 x VIN = 0.0625 x VIN
  Resistors used are 0.1% tolerant. So tolerance:
  VIN_ADC = 0.06262 x VIN
  and
  VIN_ADC = 0.06238 x VIN
- Since the USB input and the 5V from the SMPS are already protected rails then we do not need to consider over-voltagee protection and can tie OV1 and OV2 to ground
- Monitoring
- Source Resistance = 150k || 10k ~ 9.4k
  100nF capacitor added to ensure ADC can source sufficient current.
  Cutoff frequency =  162 Hz
- (near R30) @{"Id":"DJVZVCWH\LZLVHCZB","ObjectType":2} Selected to set the maximum output current to around 2.5A, we are expecting an absolute maximum output current in worst case of 700mA through @{"Id":"DJVZVCWH\UOSGVFSR","ObjectType":2} so this is well within the limit.
- With a load capacitance of at least 100uF, selecting @{"Id":"DJVZVCWH\DTMKUTJD","ObjectType":2} to be 100nF, gives a Slew Rate of 780 V/s. This gives an inrush current of 780V/s x 100uF of 78mA which is manageable and ensures a reasonable switchover time.
- Power Tree
- Angus Corr

### Library data of the parts
C34 C36 = CMP-001-00103-1: 100V 100nF C0G ±5% 1206 Multilayer Ceramic Capacitors MLCC - SMD/SMT ROHS; Min Operating Temperature: -55°C; Mounting Technology: Surface Mount; Case/Package: 1206; Max Operating Temperature: 125°C; Tolerance: 5%; Voltage Rating: 100V
C35 = CMP-001-00104-1: Cap Aluminum 100uF 100V 20% (12.5 X 13.5mm) SMD 450mA 5000h 105°C T/R; Mounting Technology: Surface Mount; Ripple Current: 450mA; Tolerance: 20%; Case/Package: SMD/SMT; Pins: 2; Max Operating Temperature: 105°C; Min Operating Temperature: -40°C; Voltage Rating: 100V; Ripple Current (AC): 450mA
C37 C39 C43 C44 C46 = CMP-001-00017-6: as C28 on sheet  Digital_Input; Tolerance: 10%; Mounting Technology: SM; Max Operating Temperature: 125°C; RoHS Compliant: True; Pins: 2; Case/Package: 0603; Min Operating Temperature: -55°C
C38 C40-C42 = CMP-001-00139-1: 25V 10uF X7R ±10% 1206 Multilayer Ceramic Capacitors MLCC - SMD/SMT ROHS; Manufacturer Lifecycle Status: IN PRODUCTION; Min Operating Temperature: -55°C; Case/Package: 1206; Pins: 2; Voltage Rating: 25V; Max Operating Temperature: 125°C; Tolerance: 10%; Mounting Technology: Surface Mount; Case Code (Imperial): 1206; Case Code (Metric): 3216; China RoHS: Compliant; Depth: 1.6mm; Dielectric Material: Ceramic; Dielectric: X7R; Height: 1.6mm; Lead Free: Lead Free; Length: 3.2mm; Lifecycle Status: Production; Material: Ceramic; Number of Terminals: 2; Packaging: Cut Tape; Radiation Hardening: No; REACH SVHC: Yes; RoHS: Compliant; Schedule B: 8532240020, 8532240020; Termination: SMD/SMT; Thickness: 1.6mm; Voltage Rating (DC): 25V; Voltage: 25V; Width: 1.6mm
C45 = CMP-001-00005-6: Chip Capacitor, 1 uF, +/- 10%, 25 V, 0603 (1608 Metric); Capacitor Type: Ceramic; Voltage Rating: 25V; Pins: 2; Mounting Technology: SM; RoHS Compliant: True; Max Operating Temperature: 125°C; Case/Package: 0603; Min Operating Temperature: -55°C; Tolerance: 10%
D3 = CMP-004-00081-1: MMSZ5244BT1 Series 500 mW 10 mA 14 V SMT Zener Voltage Regulator - SOD-123; Manufacturer Lifecycle Status: ACTIVE; Number of Elements: 1; Zener Voltage: 14V; Impedance: 15Ω; ESD Protection: Yes; Polarity: Unidirectional; Element Configuration: Single; Power Rating: 500mW; Material: Plastic; Voltage Tolerance: 5%; Test Current: 9mA; Max Reverse Leakage Current: 100nA; Forward Voltage: 900mV; RoHS: Compliant; Lifecycle Status: Production; Lead Free: Lead Free; Case/Package: SOD-123-2; Voltage Rating (DC): 14V; Number of Terminals: 2; REACH SVHC: Yes; Height: 1.35mm; Power Dissipation: 500mW; Width: 1.8mm; Length: 2.84mm; Working Voltage: 14V; Max Power Dissipation: 500mW; Pins: 2; Composition: Zener; Zener Current: 9mA; Peak Reverse Current: 100nA; Packaging: Tape and Reel; China RoHS: Compliant; Schedule B: 8541100050, 8541100050; Tolerance: 5%; Min Operating Temperature: -55°C; Max Operating Temperature: 150°C; Contact Plating: Tin; Radiation Hardening: No; Reference Voltage: 14V
D4 = CMP-004-00047-1: Diode, Zener, Vr 47V, If 10MA, Pkg SOT-23 (TO-236), Vf 0.9V, Cj 40PF, Tj +150C, Ir 2MA; Forward Voltage: 900mV; Max Operating Temperature: 150°C; Case/Package: SOT-23-3; Pins: 3; Min Operating Temperature: -65°C
D5 = CMP-004-00082-1: as D1 on sheet  Digital_Input; Case/Package: SMA; Max Operating Temperature: 150°C; Min Operating Temperature: -55°C; Mounting Technology: Surface Mount; Pins: 2
D6 = CMP-031-00019-1: Littelfuse; Source: MAX17643ATC+.SchLib; Arrow Price/Stock: https://www.arrow.com/en/products/c106mg/littelfuse?utm_currency=USD&region=europe; Manufacturer_Part_Number: C106MG; Datasheet Link: https://m.littelfuse.com/~/media/electronics/datasheets/switching_thyristors/littelfuse_thyristor_c106_d_datasheet.pdf.pdf; Arrow Part Number: C106MG; Design Item ID: C106MG; Height: 2.8mm; Mouser Price/Stock: https://www.mouser.co.uk/ProductDetail/Littelfuse/C106MG?qs=sK5eIuwOod7zMKL78CI8oQ%3D%3D; Mouser Part Number: 863-C106MG; Manufacturer_Name: LITTELFUSE
D50 = CMP-007-00044-1: LED yellow 0603 wavelength 587~594.5nm light intensity 7.1~45mcd Front Mounting; Shape: Rectangular; Power Dissipation: 50mW; Peak Wavelength: 591nm; Number of Circuits: 1; Lens Style: Colorless, Diffused, Rectangular; Test Current: 5mA; Forward Voltage: 2.3V; Lens Transparency: Clear; Lens Color: Clear, Colorless; Viewing Angle: 130°; Forward Current: 30mA; Reverse Voltage: 5V; Luminous Intensity: 26.05mcd; Schedule B: 8541402000, 8541402000; Introduction Date: 2007-04-09; Min Operating Temperature: -55°C; RoHS: Compliant; Terminal Pitch: 1.5mm; Case/Package: 0603; Width: 800µm; Dominant Wavelength: 594.5nm; Pins: 2; Case Code (Imperial): 0603; Height: 350µm; Length: 1.6mm; Color: Yellow; Lead Free: Lead Free; Max Operating Temperature: 85°C; Wavelength: 594.5nm; Harmonized Tariff Schedule (HTS) Code: 8541.40.20.00; China RoHS: Compliant; Illumination Color: Yellow; Number of Terminals: 2; Radiation Hardening: No; Case Code (Metric): 1608; Number of LEDs: 1; Depth: 800µm; Lifecycle Status: Production; REACH SVHC: Yes; Mounting Technology: Surface Mount; Number of Elements: 1
F1 = CMP-005-00026-1: Fuse 63V Fa Halogen Free Slim 1206 2A/ T&r Rohs Compliant: Yes; Ratings: CE, CSA, EN, TUV; Current Rating: 2A; Approvals: CSA, UL; Time to Trip: 200ms; Power Dissipation: 157.5mW; Value: 30mΩ; Case/Package: 1206; Mounting Technology: Surface Mount; Lifecycle Status: Production; Height: 584µm; Case Code (Imperial): 1206; Current: 2A; Fuse Current: 2A; Housing Material: Ceramic; Length: 3.175mm; Width: 1.524mm; Min Operating Temperature: -55°C; Max Operating Temperature: 90°C; REACH SVHC: No; Case Code (Metric): 3216; Voltage Rating (AC): 63V; RoHS: Compliant; Voltage Rating (DC): 63V; Depth: 1.52mm; Voltage Rating: 63V
Q1 = CMP-013-00038-1: Dual P-Channel 60 V 0.12 Ohms Surface Mount Power Mosfet - SOIC-8; Nominal Vgs: -3V; Max Operating Temperature: 175°C; Mounting Technology: Surface Mount; Min Operating Temperature: -55°C; Case/Package: SO; Pins: 8
R22 R24 = CMP-009-00345-3: Res Thick Film 0603 100K Ohm 1% 0.1W(1/10W) ±100ppm/C Pad SMD T/R Automotive; Voltage Rating: 75V; Max Power Dissipation: 100mW; Temperature Coefficient: 100ppm/°C; Max Operating Temperature: 155°C; Tolerance: 1%; Case/Package: 0603; Mounting Technology: Surface Mount; Min Operating Temperature: -55°C; Case Code (Imperial): 0603; Case Code (Metric): 1608; China RoHS: Non-Compliant; Composition: Thick Film; Country of Origin: Mainland China, Taiwan; Depth: 800µm; Export Control Classification Number (ECCN) Code: EAR99; Features: Anti-Sulfur, Automotive AEC-Q200, Moisture Resistant; Harmonized Tariff Schedule (HTS) Code: 8533.21.00.30; Height: 450µm; Introduction Date: 2012-04-10; Lead Free: Lead Free; Length: 1.6mm; Lifecycle Status: Production; Military Standard: Not; Number of Terminals: 2; Number of Terminations: 2; Packaging: Tape & Reel; Power Rating: 100mW; Ratings: AEC-Q200; REACH SVHC: Yes; RoHS: Compliant; Schedule B: 8533210045, 8533210045; Termination: SMD/SMT; Width: 800µm; Working Voltage: 75V
R23 = CMP-009-00335-1: 100mW Thin Film Resistor 75V ±25ppm/℃ ±0.1% 100Ω 0603 Chip Resistor - Surface Mount ROHS; Temperature Coefficient: 25ppm/°C; Mounting Technology: Surface Mount; Case/Package: 0603; China RoHS: Non-Compliant; Max Operating Temperature: 155°C; Height: 450µm; Lifecycle Status: Production; Termination: SMD/SMT; Harmonized Tariff Schedule (HTS) Code: 8533.21.00.30; Working Voltage: 75V; RoHS: Compliant; Max Power Dissipation: 100mW; Country of Origin: Mainland China, Taiwan; Depth: 800µm; Voltage Rating: 75V; Composition: Thin Film; Schedule B: 8533210045, 8533210045; Number of Terminations: 2; Military Standard: Not; REACH SVHC: Yes; Voltage Rating (DC): 75V; Features: Moisture Resistant; Introduction Date: 2008-06-09; Export Control Classification Number (ECCN) Code: EAR99; Min Operating Temperature: -55°C; Power Rating: 100mW; Weight: 2.012816mg; Case Code (Imperial): 0603; Number of Terminals: 2; Lead Free: Lead Free; Width: 800µm; Tolerance: 0.1%; Length: 1.6mm
R25 R27 R31 = CMP-009-00322-1: as R7 on sheet  Digital_Input; Min Operating Temperature: -55°C; Case/Package: 0603; Mounting Technology: Surface Mount; Max Operating Temperature: 155°C; Tolerance: 0.1%; Case Code (Imperial): 0603; China RoHS: Non-Compliant; Composition: Thin Film; Country of Origin: Mainland China, Taiwan; Depth: 800µm; Export Control Classification Number (ECCN) Code: EAR99; Features: Moisture Resistant; Harmonized Tariff Schedule (HTS) Code: 8533.21.00.30; Height: 450µm; Introduction Date: 2008-06-09; Lead Free: Lead Free; Length: 1.6mm; Lifecycle Status: Production; Military Standard: Not; Number of Terminals: 2; Number of Terminations: 2; Power Rating: 100mW; REACH SVHC: Yes; RoHS: Compliant; Schedule B: 8533210045, 8533210045; Termination: SMD/SMT; Voltage Rating (DC): 75V; Weight: 2.012816mg; Width: 800µm; Working Voltage: 75V
R26 = CMP-009-00350-1: 100mW Thin Film Resistor ±25ppm/℃ ±0.1% 16.2kΩ 0603 Chip Resistor - Surface Mount ROHS; Voltage Rating (DC): 50V; Temperature Coefficient: 25ppm/°C; Voltage Rating: 75V; Tolerance: 0.1%; Termination: SMD/SMT; Composition: Thin Film; Number of Terminals: 2; Number of Terminations: 2; Max Power Dissipation: 100mW; Military Standard: Not; Features: Moisture Resistant; Length: 1.6mm; Max Operating Temperature: 155°C; Power Rating: 100mW; Case/Package: 0603; Case Code (Imperial): 0603; Lead Free: Lead Free; Height: 450µm; China RoHS: Non-Compliant; Lifecycle Status: Production; REACH SVHC: Yes; Min Operating Temperature: -55°C; Mounting Technology: Surface Mount; Width: 800µm; RoHS: Compliant; Depth: 800µm; Working Voltage: 75V
R28 = CMP-009-00333-1: Res Thick Film 0603 5.1K Ohm 1% 0.1W(1/10W) ±100ppm/C Pad SMD Automotive T/R; Voltage Rating: 75V; Max Power Dissipation: 100mW; Temperature Coefficient: 100ppm/°C; Max Operating Temperature: 155°C; Case/Package: 0603; Min Operating Temperature: -55°C; Mounting Technology: Surface Mount; Tolerance: 1%; Case Code (Imperial): 0603; Case Code (Metric): 1608; China RoHS: Non-Compliant; Composition: Thick Film; Features: Automotive AEC-Q200, Moisture Resistant; Height: 450µm; Length: 1.6mm; Lifecycle Status: Production; Number of Terminals: 2; Number of Terminations: 2; Packaging: Tape & Reel; Power Rating: 100mW; Ratings: AEC-Q200; REACH SVHC: Yes; RoHS: Compliant; Schedule B: 8533210045, 8533210045; Termination: SMD/SMT; Weight: 2.012816mg; Width: 800µm; Working Voltage: 75V
R29 = CMP-009-00201-1: 125mW Thin Film Resistor 150V ±25ppm/℃ ±0.1% 150kΩ 0805 Chip Resistor - Surface Mount ROHS; Max Operating Temperature: 155°C; Case/Package: 0805; Voltage Rating: 150V; Tolerance: 0.1%; Mounting Technology: Surface Mount; Min Operating Temperature: -55°C
R30 = CMP-009-00346-1: Res Thick Film 0603 44.2K Ohm 1% 0.1W(1/10W) ±100ppm/C Pad SMD T/R Automotive AEC-Q200; Temperature Coefficient: 100ppm/°C; Power Rating: 100mW; Voltage Rating: 75V; REACH SVHC: Yes; Width: 800µm; Features: Automotive AEC-Q200, Moisture Resistant; Harmonized Tariff Schedule (HTS) Code: 8533.21.00.30; Ratings: AEC-Q200; Schedule B: 8533210045, 8533210045; China RoHS: Non-Compliant; Min Operating Temperature: -55°C; Height: 450µm; Number of Terminals: 2; Case/Package: 0603; Country of Origin: Mainland China, Taiwan; Lifecycle Status: Production; Introduction Date: 2012-04-10; Export Control Classification Number (ECCN) Code: EAR99; Tolerance: 1%; Length: 1.6mm; Composition: Thick Film; Max Power Dissipation: 100mW; Number of Terminations: 2; Mounting Technology: Surface Mount; Packaging: Tape & Reel; RoHS: Compliant; Working Voltage: 75V; Lead Free: Lead Free; Max Operating Temperature: 155°C
R33 = CMP-009-00357-1: 100mW Thick Film Resistors 75V ±100ppm/℃ ±1% 12kΩ 0603 Chip Resistor - Surface Mount ROHS; Voltage Rating: 50V; Temperature Coefficient: 100ppm/°C; Voltage Rating (DC): 50V; Tolerance: 1%; Composition: Thick Film; Length: 1.6mm; Min Operating Temperature: -55°C; Schedule B: 8533210045, 8533210045; Power Rating: 100mW; Max Operating Temperature: 155°C; Height: 450µm; China RoHS: Non-Compliant; Packaging: Tape and Reel; Width: 800µm; Pins: 2; REACH SVHC: Yes; Case/Package: 0603; RoHS: Compliant; Lifecycle Status: Production; Number of Terminals: 2; Mounting Technology: Surface Mount; Working Voltage: 75V; Case Code (Imperial): 0603; Case Code (Metric): 1608; Depth: 800µm; Features: Moisture Resistant; Lead Free: Lead Free; Max Power Dissipation: 100mW; Military Standard: Not; Number of Terminations: 2; Termination: SMD/SMT
TP9-TP14 = CMP-00028-00002-2: 0.6mm round; Pins: 1
U4 = CMP-031-00027-2: 74HC(T)238 - 3-to-8 line decoder/demultiplexer@en-us; Manufacturer_Name: Nexperia; Height: 1.75mm; Design Item ID: 74HC238D,653; Manufacturer_Part_Number: 74HC238D,653; Mouser Part Number: 771-74HC238D-T; Arrow Part Number: 74HC238D,653; Arrow Price/Stock: https://www.arrow.com/en/products/74hc238d653/nexperia.html?utm_currency=USD&region=europe; Mouser Price/Stock: https://www.mouser.co.uk/ProductDetail/Nexperia/74HC238D653?qs=P62ublwmbi8dvjtlyD3gOA%3D%3D; Datasheet Link: https://assets.nexperia.com/documents/data-sheet/74HC_HCT238.pdf; Source: MAX17643ATC+.SchLib
U5 = CMP-031-00010-1: 2.7-V to 22-V, 56-mΩ, 4.5-A, power mux with seamless switchover 12-VQFN-HR -40 to 125; Min Supply Voltage: 2.8V; Max Supply Voltage: 22V; Pins: 12; Min Operating Temperature: -40°C; Max Operating Temperature: 125°C